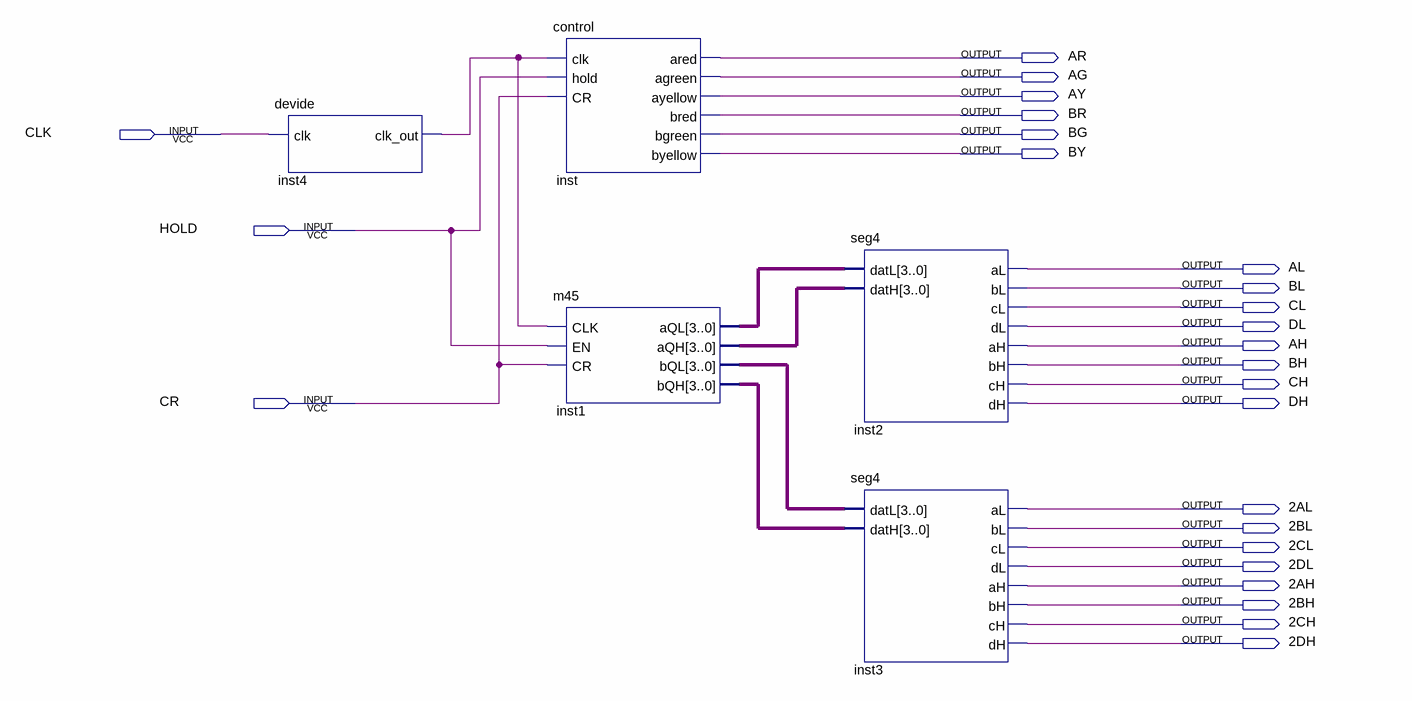
[diagram p0: schematic sheet]
// Quartus schematic item_1.bdf as structural Verilog: 5 symbols, 25 pins
module item_1 (
  input  CLK,
  input  HOLD,
  input  CR,
  output AR,
  output AG,
  output AY,
  output BR,
  output BG,
  output BY,
  output AL,
  output BL,
  output CL,
  output DL,
  output AH,
  output BH,
  output CH,
  output DH,
  output \2AL ,
  output \2BL ,
  output \2CL ,
  output \2DL ,
  output \2AH ,
  output \2BH ,
  output \2CH ,
  output \2DH 
);

  wire inst4_clk_out;
  wire [3:0] inst1_aqh, inst1_aql, inst1_bqh, inst1_bql;

  devide inst4 (.clk(CLK), .clk_out(inst4_clk_out));
  control inst (
    .clk(inst4_clk_out), .hold(HOLD), .CR(CR), .ared(AR), .agreen(AG), .ayellow(AY), .bred(BR), .bgreen(BG),
    .byellow(BY));
  m45 inst1 (
    .CLK(inst4_clk_out), .EN(HOLD), .CR(CR), .aQL(inst1_aql), .aQH(inst1_aqh), .bQL(inst1_bql),
    .bQH(inst1_bqh));
  seg4 inst2 (
    .datL(inst1_aql), .datH(inst1_aqh), .aL(AL), .bL(BL), .cL(CL), .dL(DL), .aH(AH), .bH(BH), .cH(CH), .dH(DH));
  seg4 inst3 (
    .datL(inst1_bql), .datH(inst1_bqh), .aL(\2AL ), .bL(\2BL ), .cL(\2CL ), .dL(\2DL ), .aH(\2AH ),
    .bH(\2BH ), .cH(\2CH ), .dH(\2DH ));
endmodule
